# EAGLE board slave_board (EAGLE 9.2.2)
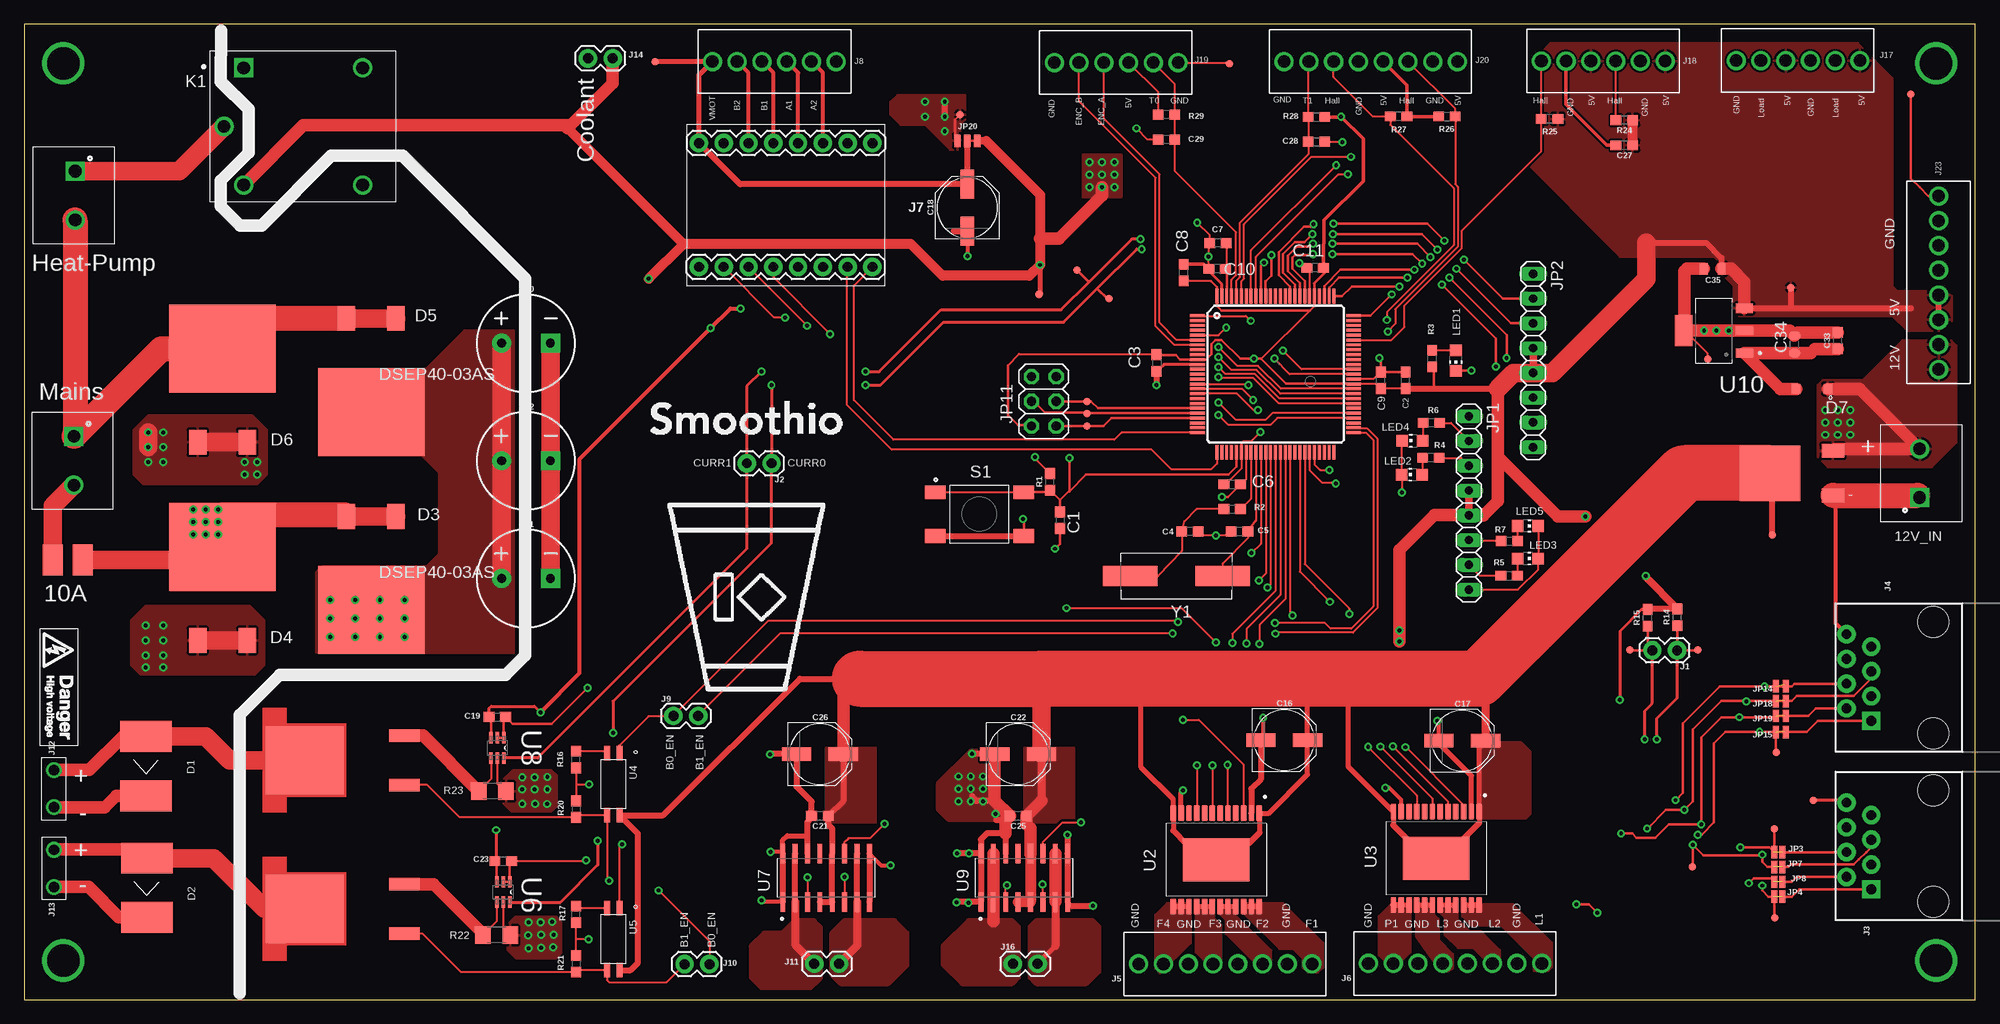
[diagram p6: board, top side]
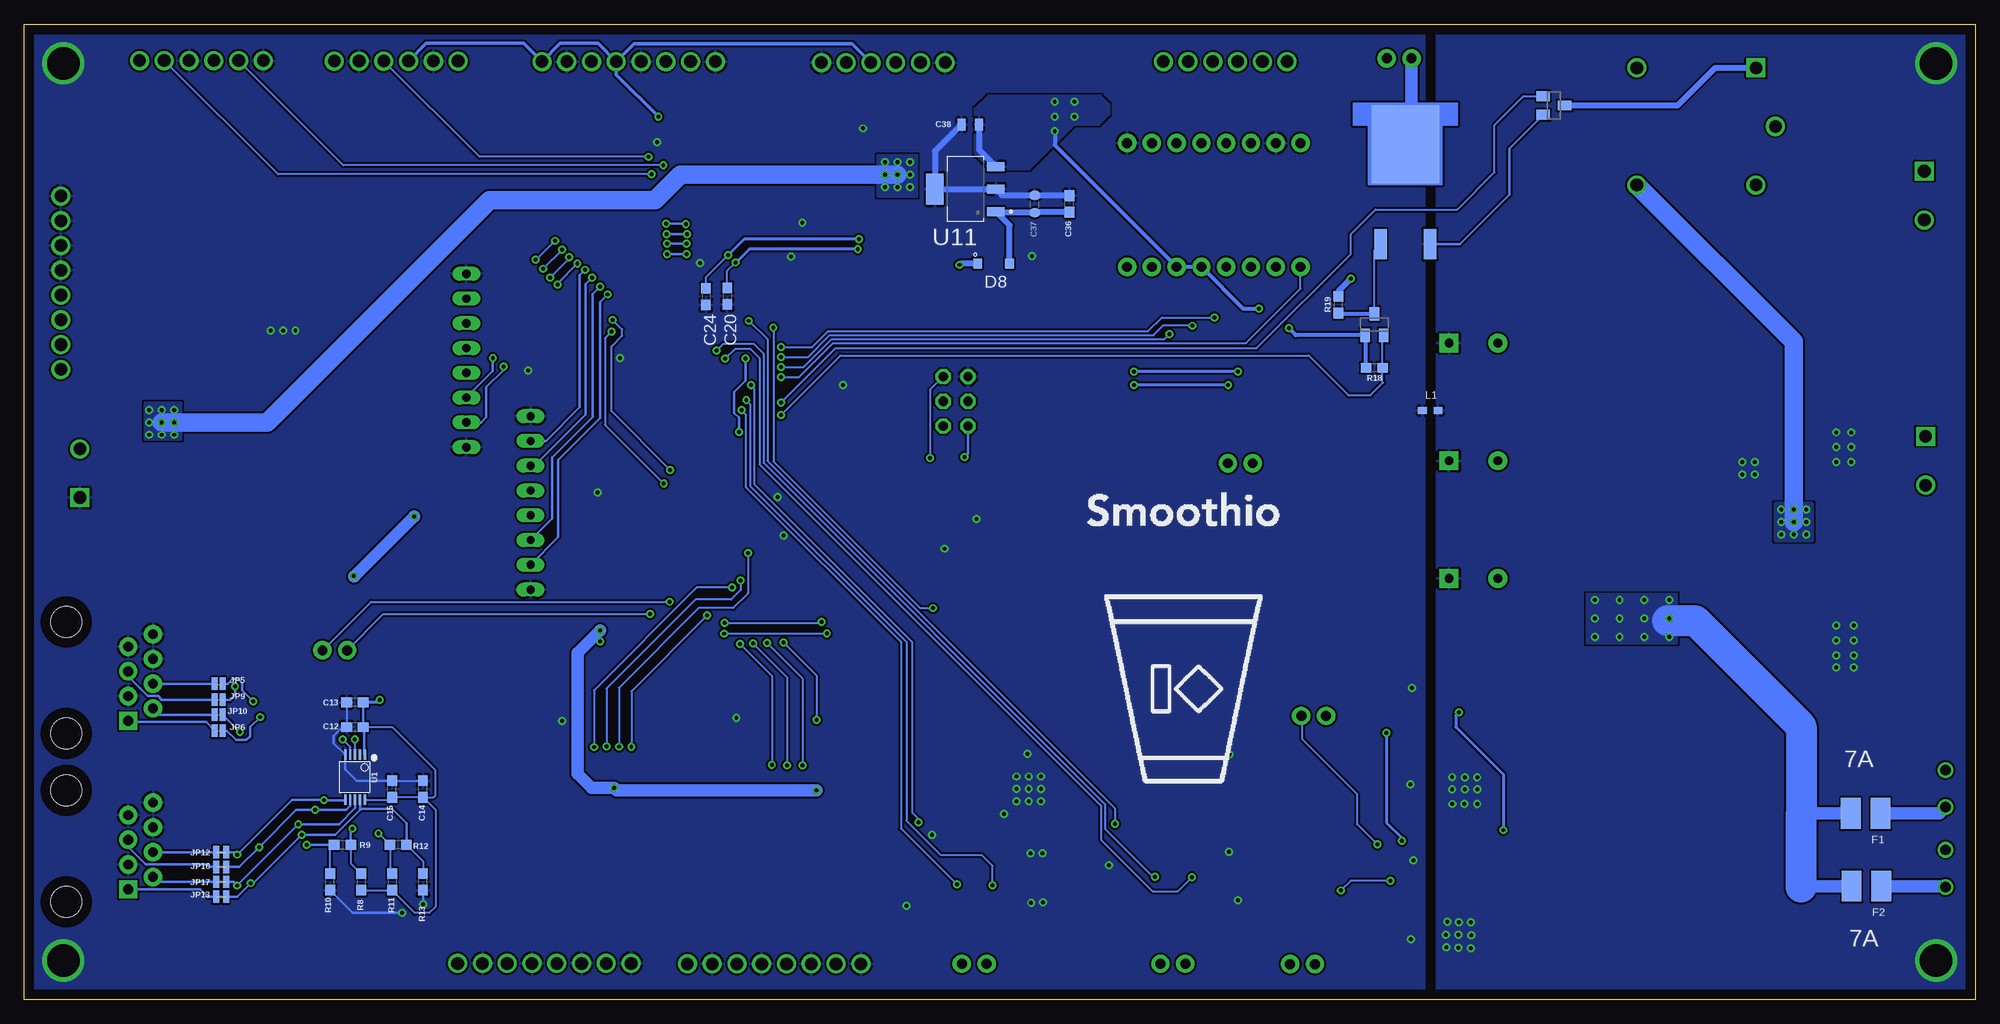
[diagram p7: board, bottom side, seen from below]

Size 200 x 100 mm. Coordinates in mm from the lower left corner, seen from the top.
Outline: 0,0 200,0 200,100 0,100 0,0
Copper layers (1*16): Top 0.07mm / dielectric 1.5mm / Bottom 0.07mm
Design rules "default *": minimum track width 6mil, minimum drill 0.35mm, track to track 8mil, track to pad 8mil, pad to pad 8mil, via to via 8mil, smd to smd 6mil, copper to edge 40mil, drill to drill 6mil, minimum pad ring 10mil, minimum via ring 8mil, stop-mask expansion 4mil, vias tented up to drill 0mil, thermal gap 10mil
Net classes: 0 default: width 0.203 mm, drill 0.406 mm, clearance 0.203 mm; 1 power: width 0.508 mm, drill 0.406 mm, clearance 0.254 mm; 2 gnd: width 0.203 mm, drill 0.406 mm, clearance 0.203 mm; 3 mains: width 1.905 mm, drill 0.406 mm, clearance 2.286 mm; 4 HVDC: width 1.27 mm, drill 0.406 mm, clearance 2.032 mm

## Footprints (pad centres in the part's own frame; a part is rotated, then mirrored left to right if it is on the bottom)
C0603 = smd 1.1 x 1: 1 -0.85,0; 2 0.85,0
0603 = smd 1.1 x 1: 1 -0.85,0; 2 0.85,0
PANASONIC_D = smd 3 x 1.4: + 2.4,0; - -2.4,0
UCS2E470MHD1TO = drill 0.9 pad 1.93: + -2.5,0 | drill 0.9 pad 1.93 square: - 2.5,0
C0603-ROUND = smd 0.898 x 1.1: 1 -0.889,0; 2 0.889,0
0805 = smd 0.8 x 1.2: 1 -0.9,0; 2 0.9,0
SK520TR = smd 3.175 x 5.283: 1 -3.175,0; 2 2.896,0
DSEP40-03AS = smd 1.778 x 2.54: 1 -2.54,0; 3 2.54,0 | smd 10.922 x 9.017: 4 0,9.588
MBR0530 = smd 0.899 x 1.021: 1 -1.778,0; 2 1.491,0
SSQ7 = smd 2.032 x 3.175: 1 1.524,0; 2 -1.524,0
SSQ10 = smd 2.032 x 3.175: 1 1.524,0; 2 -1.524,0
TQFP100 = smd 1.5 x 0.3: 1 -8,6; 2 -8,5.5; 3 -8,5; 4 -8,4.5; 5 -8,4; 6 -8,3.5; 7 -8,3; 8 -8,2.5; 9 -8,2; 10 -8,1.5; 11 -8,1; 12 -8,0.5; 13 -8,0; 14 -8,-0.5; 15 -8,-1; 16 -8,-1.5; 17 -8,-2; 18 -8,-2.5; 19 -8,-3; 20 -8,-3.5; 21 -8,-4; 22 -8,-4.5; 23 -8,-5; 24 -8,-5.5; 25 -8,-6; 51 8,-6; 52 8,-5.5; 53 8,-5; 54 8,-4.5; 55 8,-4; 56 8,-3.5; 57 8,-3; 58 8,-2.5; 59 8,-2; 60 8,-1.5; 61 8,-1; 62 8,-0.5; 63 8,0; 64 8,0.5; 65 8,1; 66 8,1.5; 67 8,2; 68 8,2.5; 69 8,3; 70 8,3.5; 71 8,4; 72 8,4.5; 73 8,5; 74 8,5.5; 75 8,6 | smd 0.3 x 1.5: 26 -6,-8; 27 -5.5,-8; 28 -5,-8; 29 -4.5,-8; 30 -4,-8; 31 -3.5,-8; 32 -3,-8; 33 -2.5,-8; 34 -2,-8; 35 -1.5,-8; 36 -1,-8; 37 -0.5,-8; 38 0,-8; 39 0.5,-8; 40 1,-8; 41 1.5,-8; 42 2,-8; 43 2.5,-8; 44 3,-8; 45 3.5,-8; 46 4,-8; 47 4.5,-8; 48 5,-8; 49 5.5,-8; 50 6,-8; 76 6,8; 77 5.5,8; 78 5,8; 79 4.5,8; 80 4,8; 81 3.5,8; 82 3,8; 83 2.5,8; 84 2,8; 85 1.5,8; 86 1,8; 87 0.5,8; 88 0,8; 89 -0.5,8; 90 -1,8; 91 -1.5,8; 92 -2,8; 93 -2.5,8; 94 -3,8; 95 -3.5,8; 96 -4,8; 97 -4.5,8; 98 -5,8; 99 -5.5,8; 100 -6,8
1X02 = drill 1.016 pad 1.88: 1 0,0; 2 2.54,0
RJ45-8 = drill 1 pad 1.88 square: 1 -4.445,6.35 | drill 1 pad 1.88: 2 -3.175,8.89; 3 -1.905,6.35; 4 -0.635,8.89; 5 0.635,6.35; 6 1.905,8.89; 7 3.175,6.35; 8 4.445,8.89 | hole 3.2: -5.715,0; 5.715,0
8PIN_SCREW_TERMINAL = drill 1.3: 1 1.5,3.25; 2 4.04,3.25; 3 6.58,3.25; 4 9.12,3.25; 5 11.66,3.25; 6 14.2,3.25; 7 16.74,3.25; 8 19.28,3.25
DRV8825CARRIER = drill 1.016 pad 1.88: /EN 0,0; /FLT 15.24,12.7; /RESET 10.16,0; /SLEEP 12.7,0; A1 10.16,12.7; A2 12.7,12.7; B1 7.62,12.7; B2 5.08,12.7; DIR 17.78,0; GND 2.54,12.7; GND1 17.78,12.7; M0 2.54,0; M1 5.08,0; M2 7.62,0; STEP 15.24,0; V-STEPPER 0,12.7
6PIN_SCREW_TERMINAL = drill 1.3: 1 1.5,3.25; 2 4.04,3.25; 3 6.58,3.25; 4 9.12,3.25; 5 11.66,3.25; 6 14.2,3.25
1X02_BIG = drill 1.067: P$1 0,0; P$2 3.81,0
PHOENIX_1935161 = drill 1.3 square: 1 -2.5,0 | drill 1.3: 2 2.5,0
1X08 = drill 0.85 pad 1.422 long: 1 -8.89,0; 2 -6.35,0; 3 -3.81,0; 4 -1.27,0; 5 1.27,0; 6 3.81,0; 7 6.35,0; 8 8.89,0
SMT-JUMPER_2_NO_NO-SILK = smd 0.635 x 1.27: 1 -0.406,0; 2 0.406,0
2X03 = drill 0.95 pad 1.55 octagon: 1 -2.54,-1.27; 2 -2.54,1.27; 3 0,-1.27; 4 0,1.27; 5 2.54,-1.27; 6 2.54,1.27
SMT-JUMPER_2_NC_TRACE_NO-SILK = smd 0.635 x 1.27: 1 -0.508,0; 2 0.508,0
SMT-JUMPER_3_1-NC_TRACE_NO-SILK = smd 0.635 x 1.27: 1 -1.016,0; 2 0,0; 3 1.016,0
ORWH-SH-112D1F = drill 1.3 square: A1 -6.1,6 | drill 1.3: A2 -6.1,-6; COM -8.1,0; NC 6.1,6; NO 6.1,-6
742792651 = smd 0.9 x 0.7: P$1 0.8,0; P$2 -0.8,0
CHIP-LED0805 = smd 1.2 x 1.2: A 0,-1.05; C 0,1.05
BSS138L = smd 1 x 1.4: D 0,1.1; G -0.95,-1.1; S 0.95,-1.1
PHB45NQ15T = smd 1.295 x 3.099: 1 -2.54,0; 3 2.54,0 | smd 6.985 x 8.001: 2 0,10.249
IRFR9024TRPBF = smd 5.69 x 6.172: D 0,6.439 | smd 1.397 x 2.286: G -2.286,0; S 2.286,0
CSR1206FT50L0 = smd 1.6 x 1.8: 1 -1.4,0; 2 1.4,0
FSM2JSMA = smd 2.1 x 1.4: 1 -4.55,2.25; 2 4.55,2.25; 3 -4.55,-2.25; 4 4.55,-2.25
PAD.03X.03 = smd 0.762 x 0.762: P$1 0,0
SPARKFUN-IC-COMMS_TSSOP10 = smd 1.1 x 0.25: 1 -2.259,1.018; 2 -2.259,0.517; 3 -2.259,0.018; 4 -2.259,-0.482; 5 -2.259,-0.988; 6 2.366,-0.988; 7 2.366,-0.482; 8 2.366,0.018; 9 2.366,0.517; 10 2.366,1.018
SOP80P1030X245-25N = smd 1.66 x 0.6: 1 -4.78,4.4; 2 -4.78,3.6; 3 -4.78,2.8; 4 -4.78,2; 5 -4.78,1.2; 6 -4.78,0.4; 7 -4.78,-0.4; 8 -4.78,-1.2; 9 -4.78,-2; 10 -4.78,-2.8; 11 -4.78,-3.6; 12 -4.78,-4.4; 13 4.78,-4.4; 14 4.78,-3.6; 15 4.78,-2.8; 16 4.78,-2; 17 4.78,-1.2; 18 4.78,-0.4; 19 4.78,0.4; 20 4.78,1.2; 21 4.78,2; 22 4.78,2.8; 23 4.78,3.6; 24 4.78,4.4 | smd 4.4 x 6.8: 25 0,0
EL3H7 = smd 1.5 x 0.6: 1 -3.175,0.635; 2 -3.175,-0.635; 3 3.175,-0.635; 4 3.175,0.635
SOT65P210X110-6N = smd 1.168 x 0.356: 1 -1.041,0.66; 2 -1.041,0; 3 -1.041,-0.66; 4 1.041,-0.66; 5 1.041,0; 6 1.041,0.66
VNH7070ASTR = smd 1.97 x 0.57: 1 -2.475,4.445; 2 -2.475,3.175; 3 -2.475,1.905; 4 -2.475,0.635; 5 -2.475,-0.635; 6 -2.475,-1.905; 7 -2.475,-3.175; 8 -2.475,-4.445; 9 2.475,-4.445; 10 2.475,-3.175; 11 2.475,-1.905; 12 2.475,-0.635; 13 2.475,0.635; 14 2.475,1.905; 15 2.475,3.175; 16 2.475,4.445
SOT230P700X180-4N = smd 1.76 x 0.93: 1 -3.125,2.3; 2 -3.125,0; 3 -3.125,-2.3 | smd 1.76 x 3.19: 4 3.125,0
ABLS-16.000MHZ-B4-T = smd 5.6 x 2.1: 1 -4.75,0; 2 4.75,0

## Placement (x,y rotation side)
C1  100n  [C0603]  106.17,49.15 270 top
C2  4.7uF  [C0603]  141.6,63.5 90 top
C3  100n  [C0603]  116.08,65.28 270 top
C4  15pF  [C0603]  119.51,48.01 180 top
C5  15pF  [C0603]  124.59,48.01 0 top
C6  100n  [C0603]  123.83,52.83 0 top
C7  1.0uF  [0603]  122.38,77.57 180 top
C8  100n  [C0603]  118.87,74.55 90 top
C9  100nF  [C0603]  139.06,63.5 90 top
C10  100n  [C0603]  122.3,74.93 180 top
C11  100n  [C0603]  132.33,75.03 180 top
C12  0.1uF  [C0603]  166.12,27.94 180 bottom
C13  1.0uF  [C0603]  166.12,30.48 180 bottom
C14  0.1uF  [C0603]  159.13,21.59 90 bottom
C15  1.0uF  [C0603]  162.31,21.59 90 bottom
C16  47uF  [PANASONIC_D]  129.17,26.6 0 top
C17  47uF  [PANASONIC_D]  147.42,26.54 0 top
C18  47uF  [PANASONIC_D]  96.67,81.2 90 top
C19  0.1uF  [C0603]  48.49,28.98 0 top
C20  0.1uF  [C0603]  127.94,72.14 270 bottom
C21  0.1uF  [C0603]  81.56,18.82 180 top
C22  47uF  [PANASONIC_D]  101.88,25.17 0 top
C23  0.1uF  [C0603]  49.1,14.2 0 top
C24  0.1uF  [C0603]  130.12,72.09 270 bottom
C25  0.1uF  [C0603]  101.88,18.82 180 top
C26  47uF  [PANASONIC_D]  81.56,25.17 0 top
C27  0.1uF  [0603]  164.02,87.6 180 top
C28  0.1uF  [0603]  132.48,87.97 0 top
C29  0.1uF  [0603]  117.1,88.18 180 top
C30  UCS2E470MHD1TO  [UCS2E470MHD1TO]  51.44,67.31 0 top
C31  UCS2E470MHD1TO  [UCS2E470MHD1TO]  51.44,43.18 0 top
C32  UCS2E470MHD1TO  [UCS2E470MHD1TO]  51.44,55.24 0 top
C33  1.0uF  [0603]  185.93,67.56 90 top
C34  100n  [C0603-ROUND]  181.48,67.18 90 top
C35  10uF  [0805]  173.1,74.93 180 top
C36  1.0uF  [0603]  92.86,81.58 90 bottom
C37  100n  [C0603-ROUND]  96.42,81.58 90 bottom
C38  10uF  [0805]  103.02,89.71 180 bottom
D1  SK520TR  [SK520TR]  12.47,23.8 270 top
D2  SK520TR  [SK520TR]  12.55,11.33 270 top
D3  DSEP40-03AS  [DSEP40-03AS]  35.56,49.53 180 top
D4  DSEP40-03AS  [DSEP40-03AS]  20.32,36.83 0 top
D5  DSEP40-03AS  [DSEP40-03AS]  35.56,69.85 180 top
D6  DSEP40-03AS  [DSEP40-03AS]  20.32,57.15 0 top
D7  MBR0530  [MBR0530]  183.13,62.61 180 top
D8  MBR0530  [MBR0530]  100.48,75.49 0 bottom
F1  SSQ7  [SSQ7]  11.23,19.08 180 bottom
F2  SSQ7  [SSQ7]  11.15,11.63 180 bottom
F3  SSQ10  [SSQ10]  4.45,45.09 180 top
IC1  ATMEGA2560-16AU  [TQFP100]  128.27,64.14 0 top
J1  [1X02]  169.44,35.81 180 top
J2  [1X02]  76.61,54.99 180 top
J3  RJ45  [RJ45-8]  195.71,15.75 90 top
J4  RJ45  [RJ45-8]  195.71,33.02 90 top
J5  OSTVN08A150  [8PIN_SCREW_TERMINAL]  112.74,0.4 0 top
J6  OSTVN08A150  [8PIN_SCREW_TERMINAL]  136.3,0.45 0 top
J7  DRV8825CARRIER  [DRV8825CARRIER]  69.16,75.13 0 top
J8  OSTVN06A150  [6PIN_SCREW_TERMINAL]  84.73,99.44 180 top
J9  [1X02]  66.55,29.08 0 top
J10  [1X02]  70.23,3.63 180 top
J11  [1X02]  80.98,3.66 0 top
J12  [1X02_BIG]  3.02,19.72 90 top
J13  [1X02_BIG]  3.03,11.54 90 top
J14  [1X02]  60.33,96.52 180 top
J15  1935161  [PHOENIX_1935161]  5.21,82.45 270 top
J16  [1X02]  101.35,3.66 0 top
J17  OSTVN06A150  [6PIN_SCREW_TERMINAL]  174,93.04 0 top
J18  OSTVN06A150  [6PIN_SCREW_TERMINAL]  154.03,92.99 0 top
J19  OSTVN06A150  [6PIN_SCREW_TERMINAL]  104.09,92.84 0 top
J20  OSTVN08A150  [8PIN_SCREW_TERMINAL]  127.66,92.93 0 top
J21  1935161  [PHOENIX_1935161]  5.08,55.24 270 top
J22  1935161  [PHOENIX_1935161]  194.31,53.98 90 top
J23  OSTVN08A150  [8PIN_SCREW_TERMINAL]  193,83.9 270 top
JP1  8x1F-H8.5  [1X08]  148.11,50.93 270 top
JP2  8x1F-H8.5  [1X08]  154.69,65.53 270 top
JP3  JUMPER-SMT_2_NO_NO-SILK  [SMT-JUMPER_2_NO_NO-SILK]  179.83,15.11 0 top
JP4  JUMPER-SMT_2_NO_NO-SILK  [SMT-JUMPER_2_NO_NO-SILK]  179.83,10.54 0 top
JP5  JUMPER-SMT_2_NO_NO-SILK  [SMT-JUMPER_2_NO_NO-SILK]  180.09,32.38 180 bottom
JP6  JUMPER-SMT_2_NO_NO-SILK  [SMT-JUMPER_2_NO_NO-SILK]  180.09,27.56 180 bottom
JP7  JUMPER-SMT_2_NO_NO-SILK  [SMT-JUMPER_2_NO_NO-SILK]  179.83,13.59 0 top
JP8  JUMPER-SMT_2_NO_NO-SILK  [SMT-JUMPER_2_NO_NO-SILK]  179.83,12.06 0 top
JP9  JUMPER-SMT_2_NO_NO-SILK  [SMT-JUMPER_2_NO_NO-SILK]  180.09,30.73 180 bottom
JP10  JUMPER-SMT_2_NO_NO-SILK  [SMT-JUMPER_2_NO_NO-SILK]  180.09,29.21 180 bottom
JP11  3x2M  [2X03]  104.52,61.34 90 top
JP12  JUMPER-SMT_2_NC_TRACE_NO-SILK  [SMT-JUMPER_2_NC_TRACE_NO-SILK]  179.83,15.11 0 bottom
JP13  JUMPER-SMT_2_NC_TRACE_NO-SILK  [SMT-JUMPER_2_NC_TRACE_NO-SILK]  179.83,10.54 0 bottom
JP14  JUMPER-SMT_2_NC_TRACE_NO-SILK  [SMT-JUMPER_2_NC_TRACE_NO-SILK]  180.09,32.13 180 top
JP15  JUMPER-SMT_2_NC_TRACE_NO-SILK  [SMT-JUMPER_2_NC_TRACE_NO-SILK]  180.09,27.43 180 top
JP16  JUMPER-SMT_2_NC_TRACE_NO-SILK  [SMT-JUMPER_2_NC_TRACE_NO-SILK]  179.83,13.59 0 bottom
JP17  JUMPER-SMT_2_NC_TRACE_NO-SILK  [SMT-JUMPER_2_NC_TRACE_NO-SILK]  179.83,12.06 0 bottom
JP18  JUMPER-SMT_2_NC_TRACE_NO-SILK  [SMT-JUMPER_2_NC_TRACE_NO-SILK]  180.09,30.61 180 top
JP19  JUMPER-SMT_2_NC_TRACE_NO-SILK  [SMT-JUMPER_2_NC_TRACE_NO-SILK]  180.09,29.08 180 top
JP20  JUMPER-SMT_3_1-NC_TRACE_NO-SILK  [SMT-JUMPER_3_1-NC_TRACE_NO-SILK]  96.67,88.06 0 top
K1  ORWH-SH-112D1F  [ORWH-SH-112D1F]  28.57,89.53 0 top
L1  742792651  [742792651]  55.85,60.4 0 bottom
LED1  GREEN  [CHIP-LED0805]  146.76,65.53 180 top
LED2  GREEN  [CHIP-LED0805]  142.27,53.82 90 top
LED3  GREEN  [CHIP-LED0805]  154.15,45.21 270 top
LED4  GREEN  [CHIP-LED0805]  142.32,57.3 90 top
LED5  GREEN  [CHIP-LED0805]  154.15,48.56 270 top
Q1  BSS138L  [BSS138L]  43.18,91.69 270 bottom
Q2  BSS138L  [BSS138L]  61.59,69.22 0 bottom
Q3  PHB45NQ15T  [PHB45NQ15T]  58.42,77.47 0 bottom
Q4  PHB45NQ15T  [PHB45NQ15T]  38.96,24.54 90 top
Q5  PHB45NQ15T  [PHB45NQ15T]  38.96,9.3 90 top
Q6  IRFR9024TRPBF  [IRFR9024TRPBF]  185.42,53.98 90 top
R1  10k  [0603]  105.16,53.09 90 top
R2  0  [0603]  123.83,50.29 0 top
R3  1k  [0603]  144.32,65.74 90 top
R4  1k  [0603]  144.2,55.55 180 top
R5  1k  [0603]  152.22,43.46 0 top
R6  1k  [0603]  144.25,59.13 180 top
R7  1k  [0603]  152.25,47.02 0 top
R8  390  [0603]  165.48,12.06 270 bottom
R9  100  [0603]  167.39,15.88 0 bottom
R10  390  [0603]  168.66,12.06 90 bottom
R11  390  [0603]  162.31,12.06 270 bottom
R12  100  [0603]  161.67,15.88 180 bottom
R13  390  [0603]  159.13,12.06 90 bottom
R14  4.7k  [0603]  169.47,39.19 90 top
R15  4.7k  [0603]  166.42,39.14 90 top
R16  220  [0603]  56.57,24.61 90 top
R17  220  [0603]  56.57,8.74 90 top
R18  10k  [0603]  61.59,64.77 180 bottom
R19  10k  [0603]  65.28,71.25 90 bottom
R20  1M  [0603]  56.57,19.53 270 top
R21  1M  [0603]  56.57,3.66 270 top
R22  CSR1206FT50L0  [CSR1206FT50L0]  48.41,6.6 180 top
R23  CSR1206FT50L0  [CSR1206FT50L0]  47.98,21.36 180 top
R24  10k  [0603]  164.02,90.17 180 top
R25  10k  [0603]  156.36,90.3 180 top
R26  10k  [0603]  145.85,90.55 0 top
R27  10k  [0603]  140.89,90.55 180 top
R28  51K  [0603]  132.48,90.51 0 top
R29  51K  [0603]  117.1,90.74 180 top
S1  FSM2JSMA  [FSM2JSMA]  97.92,49.78 0 top
TP1  TEST-POINT3  [PAD.03X.03]  111.2,71.86 0 top
TP2  TEST-POINT3  [PAD.03X.03]  104.04,72.31 90 top
TP3  TEST-POINT3  [PAD.03X.03]  172.59,65.66 90 top
TP4  TEST-POINT3  [PAD.03X.03]  183.39,20.45 90 top
TP5  TEST-POINT3  [PAD.03X.03]  193.42,92.84 90 top
TP6  TEST-POINT3  [PAD.03X.03]  123.57,95.99 90 top
TP7  TEST-POINT3  [PAD.03X.03]  108.97,60.07 90 top
TP8  TEST-POINT3  [PAD.03X.03]  108.97,58.8 90 top
TP9  TEST-POINT3  [PAD.03X.03]  108.97,61.34 90 top
TP10  TEST-POINT3  [PAD.03X.03]  179.43,17.53 90 top
TP11  TEST-POINT3  [PAD.03X.03]  170.99,13.61 90 top
TP12  TEST-POINT3  [PAD.03X.03]  179.48,8.38 90 top
TP13  TEST-POINT3  [PAD.03X.03]  179.6,25.32 90 top
TP14  TEST-POINT3  [PAD.03X.03]  171.55,35.84 90 top
TP15  TEST-POINT3  [PAD.03X.03]  164.59,35.84 90 top
TP16  TEST-POINT3  [PAD.03X.03]  64.67,96.16 90 top
TP17  TEST-POINT3  [PAD.03X.03]  179.2,47.62 90 top
TP18  TEST-POINT3  [PAD.03X.03]  181.1,73.03 90 top
TP19  TEST-POINT3  [PAD.03X.03]  95.91,90.73 0 top
TP20  TEST-POINT3  [PAD.03X.03]  107.92,74.8 0 top
U1  PCA9615  [SPARKFUN-IC-COMMS_TSSOP10]  166.12,22.86 270 bottom
U2  VNQ5E160KTR-E  [SOP80P1030X245-25N]  122.2,14.33 270 top
U3  VNQ5E160KTR-E  [SOP80P1030X245-25N]  144.75,14.48 270 top
U4  EL3H7  [EL3H7]  60.38,22.07 270 top
U5  EL3H7  [EL3H7]  60.38,6.2 270 top
U6  INA213AIDCKT  [SOT65P210X110-6N]  49.1,11.02 270 top
U7  VNH7070ASTR  [VNH7070ASTR]  82.19,12.47 90 top
U8  INA213AIDCKT  [SOT65P210X110-6N]  48.49,25.81 270 top
U9  VNH7070ASTR  [VNH7070ASTR]  102.51,12.47 90 top
U10  LM340MP-5.0/NOPB  [SOT230P700X180-4N]  173.23,68.58 180 top
U11  LM340MP-5.0/NOPB  [SOT230P700X180-4N]  103.53,83.11 180 bottom
Y1  ABLS-16.000MHZ-B4-T  [ABLS-16.000MHZ-B4-T]  118.11,43.43 0 top

## Tracks (layer width: path | path; a pad name or v marks a point on that pad's centre or on a via)
+5V  (via drill 0.41)
  Top 0.203: IC1.80 132.26,72.15 | IC1.61 138.54,63.13 C9.1 C2.1 | IC1.31 124.77,54.44 123.17,52.83 C6.1 | 126.85,65.67 126.85,65.71 | R29.2 116.25,93.05 J19.4 | 134.96,90.57 v135,90.53
  Top 0.254: 132.26,73.46 132.26,72.15 | C8.1 121.67,73.66 122.27,73.06 IC1.100 122.27,71.1 122.73,70.64 131.78,70.64 | R1.2 103.63,55.46 v103.63,55.63 | JP11.2 103.12,58.93 101.85,58.93 100.84,59.94 100.84,65.02 101.98,66.17 C3.1 116.14,66.06 118.06,66.06 118.49,65.64 IC1.10 121.14,65.64 121.69,66.19 121.69,67.2 122.12,67.63 122.73,67.63 124.65,65.71 v126.06,65.71 126.85,65.71 131.78,70.64 | R3.1 144.53,64.68 144.53,62.65 | IC1.80 132.27,71.13 131.78,70.64 | IC1.61 136.25,63.16 129.36,63.16 126.85,65.67 | v126.75,58.19 125.77,57.22 124.98,57.22 124.77,57 IC1.31
  Top 0.305: C11.1 133.22,74.42 132.26,73.46 | R15.2 165.8,39.99 163.58,37.77 v163.58,30.73
  Top 0.356: C11.1 133.22,79.91 137.26,83.95 137.26,88.27 v135,90.53 | R28.2 134.9,90.51 134.96,90.57 | R26.1 R27.1 141.74,93.75 J20.5
  Top 0.406: U3.11 141.16,20.49 139.93,21.72 v139.55,21.72
  Top 0.508: U2.11 118.6,21.27 v118.77,21.44
  Top 0.635: R14.2 166.47,40.04 R15.2 | C2.1 144.53,62.65 151.07,62.65 | 166.27,77.6 172.44,77.6 174,76.04 C35.1 | U10.3 181.18,70.88 | 181.18,70.88 193.44,70.88 | TP18.P$1 181.1,70.96 181.18,70.88 | J23.6 J23.5
  Top 0.762: v166.24,43.43 166.24,43.31 169.49,40.06 R14.2 | JP1.5 JP1.4 | JP2.4 JP2.5
  Top 1.016: R24.1 C27.1
  Top 1.27: C35.1 175.01,74.93 176.35,73.58 U10.3 | 151.07,62.65 151.07,55.67 | v160.02,49.53 157.21,49.53 151.07,55.67 | 151.07,55.67 151.07,51.12 149.61,49.66 JP1.5 148.08,49.68 144.55,49.68 140.97,46.1 v140.97,37.85 v140.97,36.7
  Top 1.905: 151.07,62.65 152.68,64.26 JP2.5 156.67,64.26 166.27,73.86 166.27,77.6
  Bottom 0.203: 165.18,27.86 C12.1 162.31,27.94 157.86,23.5 157.86,20.95 158.08,20.74 C14.1 | C14.1 C15.1 162.55,20.49 U1.10 | C14.1 157.86,19.47 157.86,9.53 158.5,8.89 159.98,8.89 R11.2 R8.2
  Bottom 0.254: JP11.2 103.25,56.01 v103.63,55.63 | U1.1 165.14,25.16 165.14,25.81 165.18,25.84 165.18,27.86 | C12.1 C13.1 | v126.06,65.71 126.06,63.45 127.23,62.28 127.23,60.15 126.75,59.66 v126.75,58.19
  Bottom 0.305: v163.58,30.73 163.83,30.48 C13.1
  Bottom 0.356: J20.5 141.18,98.04 145.07,98.04 J20.8 148.8,98.04 158.8,98.04 J18.3 | J20.5 137.48,98.02 115.14,98.02 J19.4 | v135,90.53 139.31,94.84 J20.5
  Bottom 0.635: 166.18,43.37 v166.24,43.43
  Bottom 1.27: v160.02,49.53 166.18,43.37 | v140.97,37.85 143.26,35.56 143.26,23.14 141.83,21.72 v139.55,21.72 139.27,21.44 v118.77,21.44
  pour Top: 175.77,70.1 191.52,70.1 193.04,68.58 196.58,68.58 197.6,69.6 197.6,72.14 197.09,72.64 192.02,72.64 191.52,73.15 191.52,94.49 187.96,98.04 156.46,98.04 153.42,95 153.42,86.36 163.58,76.2 173.23,76.2 173.74,75.69 173.74,74.68 175.26,73.15 175.26,70.61
+12V  (via drill 0.41)
  Top 0.508: v104.14,75.34 104.14,72.42
  Top 0.635: 104.14,72.42 TP2.P$1
  Top 0.762: JP20.3 98.6,88.06
  Top 1.016: 98.6,88.06 104.14,82.53 104.14,78.03 v104.14,75.34 103.02,74.22 94.13,74.22 90.88,77.47 67.56,77.47 | 67.56,77.47 v64.01,73.91 | 67.56,77.47 55.69,89.34
  Top 1.27: K1.A2 28.58,89.64 55.98,89.64 | 55.69,89.34 55.98,89.64 | 55.98,89.64 60.33,93.98 J14.1 | Q6.S 185.63,56.48 J22.2 188.17,62.61 D7.1 | 104.14,78.03 106.07,78.03 110.49,82.45 v110.49,83.31
  Bottom 0.635: D8.1 103.99,75.49 v104.14,75.34 | v64.01,73.91 65.28,72.64 R19.2
  Bottom 1.905: v185.93,59.18 175.08,59.18 152.29,81.98 135.34,81.98 132.74,84.58 v110.49,84.58
  other vias: 110.49,85.85 109.22,85.85 109.22,84.58 109.22,83.31 111.76,83.31 111.76,85.85 111.76,84.58 184.66,60.45 185.93,60.45 187.2,60.45 187.2,59.18 184.66,59.18 184.66,57.91 185.93,57.91 187.2,57.91
  pour Top: 198.07,67.06 198.07,57.1 195.58,54.61 184.91,54.61 183.9,55.63 183.9,62.99 184.4,63.5 188.47,63.5 192.53,67.56 197.56,67.56
  pour Top: 108.46,86.61 108.46,82.3 112.52,82.3 112.52,86.61
  pour Bottom: 108.46,86.61 108.46,82.3 112.52,82.3 112.52,86.61
  pour Bottom: 183.9,61.21 187.71,61.21 187.71,57.4 183.9,57.4 183.9,60.96
/EN  (via drill 0.41)
  Top 0.203: IC1.57 128.6,61.13 125.98,63.75 122.52,63.75 v122.43,63.85
  Bottom 0.203: v122.43,63.85 120.56,63.85 117.09,67.31 74.75,67.31 69.16,72.9 J7./EN
A1
  Top 0.406: J7.A1 79.32,95.02 J8.3
A2
  Top 0.406: J7.A2 81.86,95.02 J8.2
ADD_A12  (via drill 0.41)
  Top 0.254: JP2.2 151.56,71.88 v147.57,75.87 | v145.59,77.8 143.84,79.55 v134.19,79.55 | v132.18,79.53 131.9,79.25 131.21,79.25 128.6,76.64 128.6,74.28 129.77,73.12 IC1.85
  Bottom 0.254: v145.59,77.8 147.52,75.87 v147.57,75.87 | v134.19,79.55 132.21,79.55 v132.18,79.53
ADD_A13  (via drill 0.41)
  Top 0.254: JP2.3 152.4,69.34 v146.81,74.93 | v144.88,76.89 143.26,78.51 v134.16,78.51 | v132.06,78.51 131.22,77.67 130.28,77.67 129.06,76.45 129.06,74.53 130.27,73.31 IC1.84
  Bottom 0.254: v146.81,74.93 144.88,76.86 v144.88,76.89 | v134.16,78.51 v132.06,78.51
ADD_A14  (via drill 0.41)
  Top 0.254: v151.97,65.79 151.97,68.15 v146.1,74.02 | v144.15,76.15 142.8,77.5 v134.11,77.5 | v132.1,77.5 131.83,77.22 130.47,77.22 129.54,76.29 129.54,74.72 130.77,73.48 IC1.83
  Bottom 0.254: JP2.6 151.97,64.44 v151.97,65.79 | v146.1,74.02 144.15,75.97 v144.15,76.15 | v134.11,77.5 v132.1,77.5
ADD_A15  (via drill 0.41)
  Top 0.254: v150.88,64.9 150.88,67.79 v145.34,73.33 | v143.31,75.46 142.32,76.45 v134.09,76.45 | v132.1,76.45 132,76.35 130.25,76.35 130,76.1 130,74.95 131.27,73.68 IC1.82
  Bottom 0.254: JP2.7 153.19,59.18 152.65,59.72 152.65,62.79 150.88,64.57 v150.88,64.9 | v145.34,73.33 145.34,73.43 v143.31,75.46 | v134.09,76.45 v132.1,76.45
ADD_D22  (via drill 0.41)
  Top 0.203: R6.1 146.25,59.13 JP1.2
  Top 0.254: IC1.78 133.29,72.16 133.29,73.17 134.95,74.83 v142.49,74.83
  Bottom 0.254: JP1.2 146.51,57.28 143.05,60.73 143.05,74.27 v142.49,74.83
ADD_D23  (via drill 0.41)
  Top 0.203: R4.1 147.29,55.55 JP1.3
  Top 0.254: IC1.77 133.79,72.16 133.79,73.02 134.78,74.02 v141.81,74.02
  Bottom 0.254: JP1.3 147.68,54.74 142.44,59.97 142.44,73.38 v141.81,74.02
ADD_D24  (via drill 0.41)
  Top 0.203: R7.1 148.21,47.02 JP1.6
  Top 0.254: v140.97,73.13 136.09,73.13 135.08,72.11 134.29,72.11 IC1.76
  Bottom 0.254: JP1.6 145.9,49.33 145.9,55.58 141.73,59.74 141.73,72.36 v140.97,73.13
ADD_D25  (via drill 0.41)
  Top 0.203: R5.1 149.22,43.46 JP1.7
  Top 0.254: v140.18,72.31 138,70.14 IC1.75
  Bottom 0.254: JP1.7 145.26,47.42 145.26,55.32 140.97,59.61 140.97,71.53 v140.18,72.31
AREF
  Top 0.203: C7.1 123.23,75.01 C10.1
  Top 0.254: IC1.98 123.27,74.85
  Top 0.305: 123.27,74.85 C10.1
B1
  Top 0.406: J7.B1 76.78,95.02 J8.4
B2
  Top 0.406: J7.B2 74.24,95.02 J8.5
BLENDER0-
  Top 1.27: D1.1 10.11,26.98 6.66,23.53 J12.P$2
  Top 1.905: Q4.2 21.03,24.54 18.59,26.98 D1.1
BLENDER0_EN  (via drill 0.41)
  Top 0.203: IC1.51 137.52,58.13 138.3,57.35 138.3,40.31 136.04,38.05 133.91,38.05 133.32,38.63 v128.19,38.63 | v118.26,38.73 118.19,38.81 76.22,38.81 66.55,29.13 J9.1 66.52,29.06 63.98,29.06 61.01,26.09 U4.1
  Bottom 0.203: v128.19,38.63 118.36,38.63 v118.26,38.73
BLENDER0_GATE  (via drill 0.41)
  Top 0.203: Q4.1 41.3,22 44.61,18.68 R20.2 56.78,18.9 U4.3 59.74,12.39 v59.94,12.19 | v65.02,11.18 70.23,5.97 J10.1
  Bottom 0.203: v59.94,12.19 64.01,12.19 v65.02,11.18
BLENDER1-
  Top 1.27: J13.P$2 3.08,15.4 11.65,15.4 D2.1
  Top 1.905: D2.1 19.41,14.5 24.61,9.3 Q5.2
BLENDER1_EN  (via drill 0.41)
  Top 0.203: IC1.52 136.31,58.59 137.64,58.59 138.71,57.52 138.71,40.14 136.21,37.64 128.25,37.64 v128.25,37.52 | v61.29,15.9 60.98,15.6 60.98,9.4 U5.1 | v117.73,37.54 77.5,37.54 69.09,29.13 J9.2
  Bottom 0.203: v128.25,37.52 117.73,37.52 v117.73,37.54 | v61.29,15.9 63.4,18.01 63.4,21.11 69.01,26.72 69.01,29.01 J9.2
BLENDER1_GATE
  Top 0.203: Q5.1 40.82,6.76 44.77,2.81 R21.2 56.78,3.02 U5.3 59.74,1.98 59.94,1.78 65.84,1.78 J10.2
CAROUSEL_POS  (via drill 0.41)
  Top 0.203: R24.2 163.18,96.21 J18.4 | IC1.95 124.77,73.66 125.04,73.93 125.04,79.51 131.94,86.41 v136.02,86.41
  Bottom 0.203: v136.02,86.41 153.32,86.41 J18.4
COOLANT-
  Bottom 1.27: J14.2 57.78,88.35 Q3.2
COOLANT_EN  (via drill 0.41)
  Top 0.203: IC1.54 128.47,59.63 127.76,58.93 123.44,58.93 v122.43,59.94
  Bottom 0.203: Q2.S 60.74,68.02 R18.1 60.74,63.28 60.71,63.25 61.98,61.98 64.26,61.98 68.33,66.04 116.33,66.04 v122.43,59.94
COOLANT_GATE
  Bottom 0.203: Q2.D 61.59,76.83 Q3.1
  Bottom 0.406: Q2.D 65.2,70.31 R19.1
CUP_MASS0  (via drill 0.41)
  Top 0.203: IC1.93 125.77,76.82 v134.49,85.55
  Bottom 0.203: v134.49,85.55 167.29,85.55 J17.2
CUP_MASS1  (via drill 0.41)
  Top 0.203: v135.71,84.63 135.99,84.63 136.04,84.58 134.68,84.58 126.27,76.17 IC1.92
  Bottom 0.203: v135.71,84.63 174,84.63 J17.5
CURR_SENS0  (via drill 0.41)
  Top 0.254: IC1.91 126.77,75.28 v127.08,75.59
  Top 0.305: v86.23,62.99 87.76,62.99 94.23,69.47 106.55,69.47 109.98,72.9 | v114.55,76.96 114.05,76.96 109.98,72.9 | 109.98,72.9 111.02,71.86 TP1.P$1 | v58.78,16.26 58.78,13.79 54.97,9.98 U6.6 | v60.35,27.33 60.35,30.58 76.58,46.81 76.58,54.97 J2.1 76.58,55.02 v76.58,62.99
  Bottom 0.203: C20.1 127.94,74.73 v127.08,75.59
  Bottom 0.305: v76.58,62.99 v86.23,62.99 | v114.55,76.96 125.65,76.96 127.03,75.59 v127.08,75.59 | v60.35,27.33 60.35,18.14 58.78,16.56 v58.78,16.26
CURR_SENS1  (via drill 0.41)
  Top 0.254: v127.84,76.35 127.84,74.22 127.31,73.69 127.28,73.69 127.25,73.66 127.25,72.15 IC1.90
  Top 0.305: v75.56,64.39 74.07,62.89 J2.2 74.07,46.2 52.63,24.77 U8.6 | v86.23,64.39 87.63,64.39 93.98,70.74 106.3,70.74 109.18,73.62 | 109.18,73.62 113.54,77.98 v114.43,77.98 | TP20.P$1 109.11,73.62 109.18,73.62
  Bottom 0.203: C24.1 130.12,74.07 v127.84,76.35
  Bottom 0.305: v75.56,64.39 v86.23,64.39 | v114.43,77.98 126.21,77.98 v127.84,76.35
CURRSENS0-
  Top 0.203: U8.4 47.83,22.61 R23.2
  Top 1.27: Q4.3 40.87,27.08 R23.2
CURRSENS1-
  Top 0.203: U6.4 48.44,8.03 47.1,6.69
  Top 1.27: R22.2 47.1,6.69 41.96,11.84 Q5.3
DIR
  Top 0.203: IC1.25 112.49,58.13 111.76,57.4 89.1,57.4 85.04,61.47 85.04,73.23 J7.DIR
DSCL+  (via drill 0.41)  (2 unrouted)
  Top 0.254: v175.95,15.62 178.92,15.62 JP3.1 TP10.P$1 | v166.37,17.53 168.28,19.43 v170.18,19.43 171.07,20.32 171.07,27.69 173.99,30.61 176.56,30.61 | 176.56,30.61 v176.53,30.58 | JP18.2 176.56,30.61 | JP18.1 181.23,30.61 181.74,31.11 187.56,31.11 189.36,32.91 J4.5 | JP7.2 180.85,13.59 181.1,13.84 187.58,13.84 188.09,14.35 188.09,14.37 188.83,15.11 188.85,15.11 189.36,15.62 J3.5
  Bottom 0.203: R8.1 166.54,13.97 R9.2 166.6,15.94
  Bottom 0.254: JP16.2 177.98,13.59 v175.95,15.62 172.14,19.43 v170.18,19.43 167,19.43 166.6,19.84 U1.7 | R9.2 166.54,17.36 v166.37,17.53 | JP5.1 179.17,32.38 178.69,32.87 178.08,32.87 177.65,32.44 177.65,31.7 v176.53,30.58 | JP9.2 185.91,30.73 186.29,31.11 187.34,31.11 188.14,31.91 188.14,31.9 189.36,33.12 J4.5 | JP16.1 180.85,13.59 181.1,13.84 187.56,13.84 189.36,15.64 J3.5
DSCL-  (via drill 0.41)  (2 unrouted)
  Top 0.254: JP7.1 178.69,13.59 178.18,14.1 v178.18,14.86 178.13,14.81 172.14,14.81 v171.07,15.88 171.07,13.69 TP11.P$1 | JP14.2 179.55,32.11 v178.41,32.11 173.84,32.11 170.05,28.32 170.05,21.21 v169.29,20.45 | JP14.1 181.23,32.13 181.48,32.38 J4.4 | JP3.2 J3.4
  Bottom 0.203: R10.2 168.66,15.46 R9.1
  Bottom 0.254: R9.1 v171.07,15.88 | JP9.1 178.92,30.73 178.41,31.24 v178.41,32.11 | U1.6 167.15,20.45 v169.29,20.45 169.34,20.49 172.55,20.49 v178.18,14.86 178.44,15.11 JP12.2 | JP5.2 J4.4 | JP12.1 J3.4
DSDA+  (via drill 0.41)  (2 unrouted)
  Top 0.254: 178.18,11.81 v178.18,11.68 178.18,11.18 178.82,10.54 JP4.1 179.43,8.43 TP12.P$1 | JP19.2 179.45,28.96 v175.84,28.96 173.99,28.96 171.91,26.87 v171.91,17.98 168.6,17.98 167.21,16.59 165.28,16.59 164.85,17.02 v163.7,17.02 | JP19.1 182.88,29.08 183.64,29.84 J4.2 | J3.2 181.74,12.57 181.23,12.06 JP8.2
  Bottom 0.203: R11.1 162.52,13.13 R12.2 162.94,15.88
  Bottom 0.254: U1.8 166.1,19.64 167.75,17.98 v171.91,17.98 178.18,11.71 v178.18,11.68 178.56,12.06 JP17.2 | R12.2 163.66,17.02 v163.7,17.02 | v175.84,28.96 176.86,27.94 176.86,27 177.24,26.62 178.31,26.62 179.25,27.56 JP6.1 | JP10.2 186.18,29.21 J4.2 | JP17.1 186.31,12.06 J3.2
DSDA-  (via drill 0.41)  (2 unrouted)
  Top 0.254: JP8.1 179.04,12.45 177.29,12.45 v176.78,11.94 | v171.58,16.89 171.96,16.89 173.23,18.16 173.23,26.29 174.37,27.43 v177.9,27.43 JP15.2 179.58,25.35 TP13.P$1 | JP15.1 182.75,27.43 183.9,28.57 J4.1 | JP4.2 181.23,10.54 181.99,11.3 J3.1
  Bottom 0.203: R13.2 159.13,14.19 R12.1 160.82,16.3
  Bottom 0.254: 165.6,19.57 165.6,19.43 168.14,16.89 v171.58,16.89 176.53,11.94 v176.78,11.94 178.18,10.54 JP13.2 | 165.6,19.57 U1.9 | R12.1 160.82,18.07 162.31,19.57 165.6,19.57 | JP10.1 v177.9,27.43 | JP6.2 181.38,28.45 189.23,28.45 J4.1 | J3.1 181.99,11.3 181.23,10.54 JP13.1
ELEV_ENC_A  (via drill 0.41)
  Top 0.203: J20.6 146.7,91.34 R26.2 146.7,83.62 146.96,83.35 146.96,77.2 140.56,70.8 140.56,69.29 v139.78,68.5 | IC1.45 131.77,54.28 133.02,53.03 134.31,53.03 v134.44,52.91
  Bottom 0.203: v134.44,52.91 140.46,58.93 140.46,67.82 v139.78,68.5
ELEV_ENC_B  (via drill 0.41)
  Top 0.203: J20.3 134.21,96.16 134.21,94.59 138.25,90.55 R27.2 140.04,89.7 146.56,83.19 146.56,77.37 139.7,70.51 v139.7,69.7 | IC1.46 132.27,54.88 132.84,54.3 v133.78,54.3
  Bottom 0.203: v133.78,54.3 139.8,60.33 139.8,66.98 138.71,68.07 138.71,68.71 v139.7,69.7
ELEV_INA  (via drill 0.41)
  Top 0.203: U9.3 100.61,11.58 v100.74,11.71 | IC1.16 124.82,62.63 v125.98,61.47
  Bottom 0.203: v125.98,61.47 125.58,61.06 125.58,52.68 109.58,36.67 109.58,18.34 106.07,14.83 101.88,14.83 100.79,13.74 100.74,13.74 v100.74,11.71
ELEV_INB  (via drill 0.41)
  Top 0.203: U9.6 104.42,11.79 v104.39,11.81 | v126.49,60.45 125.98,60.45 124.3,62.13 IC1.17
  Bottom 0.203: v126.49,60.45 125.98,59.94 125.98,52.51 110.13,36.66 110.13,17.55 v104.39,11.81
ELEV_OUT_A
  Top 0.508: 99.34,9.25 99.34,9.3 U9.2
  Top 1.27: 99.34,9.3 U9.15 | 99.34,9.25 99.34,8.03
  pour Top (no thermals): 101.24,8.03 96.8,8.03 94.26,5.49 94.26,3.58 96.16,1.68 101.24,1.68 101.88,2.31 101.88,7.39
ELEV_OUT_B
  Top 0.508: U9.7 105.69,10.06 | 105.69,5.46 J16.2
  Top 0.813: U9.7 105.69,5.46
  Top 1.27: U9.10 105.69,10.06
  pour Top (no thermals): 109.5,8.03 103.78,8.03 103.15,7.39 103.15,2.31 103.78,1.68 108.86,1.68 110.13,2.95 110.13,7.39
ELEV_PWM  (via drill 0.41)
  Top 0.203: IC1.15 125.33,63.13 v125.48,62.99 | U9.11 104.42,16.15 106.43,18.16 v108.33,18.16
  Bottom 0.203: v125.48,62.99 125.17,62.69 125.17,52.84 108.99,36.66 108.99,19.2 108.33,18.54 v108.33,18.16
FROZEN1
  Top 0.508: U2.22 U2.23
  Top 0.635: U2.23 U2.24
  pour Top (no thermals): 124.99,9.88 124.99,8.86 128.66,5.2 130.08,5.2 131.09,4.19 131.09,3.28 131.6,2.77 132.61,2.77 133.12,3.28 133.12,5.82 129.06,9.88
FROZEN1_EN  (via drill 0.41)
  Top 0.203: IC1.5 122.44,68.14 v123.22,68.91 | v106.83,40.13 118.64,40.13 v122.17,36.6 | v118.8,28.68 120.42,28.68 124.97,24.13 124.97,19.14 U2.3
  Bottom 0.203: v123.22,68.91 123.22,55.19 108.16,40.13 v106.83,40.13 | v122.17,36.6 118.8,33.22 v118.8,28.68
FROZEN2
  Top 0.508: U2.19 U2.20 U2.21
  pour Top (no thermals): 122.45,8.86 123.22,8.1 123.22,6.72 126.9,3.04 127.8,3.94 127.8,5.04 123.98,8.86 123.98,9.37 122.45,9.37
FROZEN2_EN  (via drill 0.41)
  Top 0.203: IC1.40 129.27,41.06 126.64,38.43 v126.64,36.47 | v123.37,24.05 123.37,19.14 U2.5
  Bottom 0.203: v126.64,36.47 123.37,33.2 v123.37,24.05
FROZEN3
  Top 0.508: U2.16 U2.17 U2.18
  pour Top (no thermals): 120.09,9.37 120.09,4.82 121.77,3.15 122.65,4.04 122.65,7.65 121.95,8.36 121.95,9.37
FROZEN3_EN  (via drill 0.41)
  Top 0.203: IC1.39 128.77,41.5 125.3,38.02 v125.3,36.52 | v121.82,24 121.82,19.12 U2.7
  Bottom 0.203: v125.3,36.52 121.82,33.05 v121.82,24
FROZEN4
  Top 0.508: U2.14 U2.15
  Top 0.635: U2.13 U2.14
  pour Top (no thermals): 119.34,9.88 117.12,9.88 115.94,8.71 115.94,3.21 116.45,2.71 119.53,5.79 119.53,9.5
FROZEN4_EN  (via drill 0.41)
  Top 0.203: IC1.38 128.27,41.91 123.85,37.49 v123.85,36.58 | v120.22,24.03 120.22,19.12 U2.9
  Bottom 0.203: v123.85,36.58 120.22,32.94 v120.22,24.03
FUSE0-
  Top 1.27: D1.2 9.42,20.9 8.24,19.72 J12.P$1
  Bottom 1.27: F1.2 3.67,19.07 J12.P$1
FUSE1-
  Top 1.27: D2.2 9.69,8.43 6.58,11.54 J13.P$1
  Bottom 1.27: F2.2 3.12,11.63 J13.P$1
GND  (via drill 0.41, 3.3)
  Top 0.203: R16.1 56.57,22.07 | 56.57,22.07 R20.1 | R21.1 56.57,6.22 | 56.57,6.22 R17.1 | C11.2 131.77,74.71 IC1.81 | IC1.62 138.31,63.63 C9.2 139.1,64.35 | C6.2 125.27,53.39 IC1.32 | C5.1 123.31,47.57 v122.17,47.57 120.79,47.57 C4.1 | TP3.P$1 172.59,66.24 170.18,68.66 | C10.2 v121.41,76.2 121.41,76.3 121.4,76.31 121.4,77.44 C7.2 121.53,78.37 v120.24,79.65 | 194.31,83.31 195.22,82.4 J23.1 | LED5.C LED3.C 155.2,44.1 153.13,42.04 JP1.8 | LED4.C 141.22,57.25 LED2.C 141.22,52 v141.22,51.99 | C29.2 115.14,88.18 v114,89.33 | J19.6 123.47,96.09 TP6.P$1 | C28.2 135.1,87.97 v135.13,87.94 | 56.57,22.07 v57.91,22.07 | 56.57,6.22 57.86,6.22 v57.86,6.17 | C23.2 57.51,14.2 v57.58,14.28
  Top 0.254: U8.2 U8.1 49.15,28.9 C19.2 50.08,28.25 54.05,28.25 v57.76,31.95 | U6.2 U6.1 49.76,14.12 C23.2 | TP5.P$1 193.42,84.2 194.31,83.31 | C6.2 123.39,51.51 v122.78,51.51 | S1.4 102.47,49.17 v102.36,49.28 | C1.2 106.17,46.74 v105.66,46.23 | LED1.C 146.79,64.52 v148.34,64.52 | C9.2 139.06,65.66 v138.94,65.79 | v159.13,9.78 160.4,9.78 v161.29,8.89 | C27.2 163.15,87.57 | C2.2 139.1,64.35
  Top 0.305: IC1.99 122.77,73.36 121.45,74.72 C10.2 | IC1.11 116.82,65.14 C3.2 | J3.8 186.56,20.45 TP4.P$1
  Top 0.356: C10.2 120.9,75.44 C8.2 | C27.2 162.26,87.6 158.07,91.79 J18.2
  Top 0.406: C18.- v96.67,76.25 | C17.- 145.02,28.43 v144.88,28.57 | C16.- 127.01,26.84 v127.01,28.88 | U7.9 87.84,13.74 v88.8,13.74 | U7.1 75.78,10 v75.59,10.19 | U9.8 107.36,9.6 | Q6.G 185.67,51.44 185.67,38.61 J4.8 | U7.16 77.56,15.14 v76.5,15.14
  Top 0.508: U3.2 148.35,22.94 145.02,26.28 | U7.16 77.75,16.36 78.19,16.8 80.05,16.8 80.29,16.56 U7.14 | S1.4 102.45,47.53 | C21.2 80.71,18.61
  Top 0.61: 95.26,78.8 C18.- | C21.2 80.71,20.31 | U9.16 U9.1 | U9.9 U9.8
  Top 0.635: 80.71,20.31 79.16,21.86 C26.- 76.48,25.17 v76.45,25.15 | U7.14 80.29,18.19 80.71,18.61 | U9.14 100.61,17.04 98.7,17.04 98.07,16.41 U9.16 98,15.01 v95.63,15.01 | U7.16 U7.1 | U7.9 U7.8 | C16.- 126.77,22.6 125.8,21.63 U2.2 | 145.02,26.28 C17.- | C11.2 131.22,75.03 v130.73,75.51 | C3.2 v116.08,62.99 | S1.3 102.45,47.53 | 99.48,20.37 97.66,20.37 97.18,20.85 | 107.36,9.6 v109.58,9.6 | U9.1 95.59,10 v95.56,9.96 | v106.93,16.87 106.93,14.97 U9.9 | C25.2 100.6,18.39 99.64,18.39 | C22.- v97.16,25.17
  Top 1.27: 194.1,51.69 J22.1 | C22.- 99.48,20.37 C25.2 100.61,18.4 100.61,17.04 | C35.2 170.43,74.93 170.18,74.68 170.18,68.66 U10.4 v172.21,68.58 v173.48,68.58 v174.75,68.58 U10.2 180.97,68.58 C34.2 181.82,68.41 C33.2
  Top 2.54: Q6.G 194.1,51.69
  Bottom 0.203: C13.2 C12.2 | C15.2 C14.2
  Bottom 0.254: Q1.S 47.75,87.27 47.75,82.55 52.83,77.47 Q3.3 | C15.2 165.95,22.44 167.1,23.59 U1.5 168.28,26.29 168.28,27.05 167.39,27.94 C12.2 | R13.1 v159.13,9.78 | R10.1 166.33,8.89 v161.29,8.89
  Bottom 0.635: C38.2 106.66,86.98 U11.4 U11.2 99.77,82.47 C37.2 92.9,82.47 C36.2
  other vias: 96.85,14.99 96.77,9.93 196,4 196,96 99.57,19.05 95.76,22.86 97.03,22.86 98.3,22.86 98.3,21.59 97.03,21.59 95.76,21.59 95.76,20.32 97.03,20.32 98.3,20.32
  pour Bottom (rank 2): 203.37,-1.75 56.36,-1.75 56.36,103.06 203.37,103.06
  pour Top: 99.57,25.4 97.03,25.4 93.73,22.1 93.73,19.56 94.74,18.54 100.08,18.54 100.33,18.8 100.33,19.56 99.57,20.32
GND2  (via drill 0.41, 3.3)
  Top 0.203: U8.5 48.49,22.12 49.25,21.36 | U6.5 49.1,7.19 49.68,6.6
  Top 0.254: D6.1 18.41,57.15
  Top 1.27: 49.25,21.36 R23.1 | 49.68,6.6 R22.1
  Top 1.905: 18.41,57.15 D6.3 | D4.1 D4.3 | C30.- 53.94,54.65 53.98,54.61 53.98,43.22 C31.- | v12.7,58.17 v12.7,56.64
  other vias: 51.05,22.78 52.32,22.78 53.62,22.81 51.03,21.56 52.32,21.56 53.62,21.54 51.05,20.07 52.37,20.07 53.59,20.04 51.69,7.9 52.93,7.92 54.13,7.95 54.25,6.63 52.96,6.63 51.64,6.58 51.69,5.26 52.96,5.31 54.23,5.33 4,4 4,96 12.7,55.12 14.22,55.12 14.22,56.64 14.22,58.17 22.61,53.85 23.88,53.85 22.61,55.12 23.88,55.12 12.45,38.35 14.22,38.35 14.22,36.83 12.45,36.83 12.45,35.31 14.22,35.31 14.22,34.04 12.45,34.04
  pour Top: 49.02,22.5 49.02,20.17 49.94,19.25 54.03,19.25 54.61,19.84 54.61,22.99 54.03,23.57 50.09,23.57
  pour Top: 49.5,7.65 49.5,5.11 50.42,4.19 54.51,4.19 55.09,4.78 55.09,7.92 54.51,8.51 50.37,8.51
  pour Bottom (rank 2): -1.09,102.23 55.22,102.23 55.22,-2.69 -1.65,-2.69 -1.65,102.29
  pour Top: 11.18,58.42 11.18,53.85 12.19,52.83 23.88,52.83 24.89,53.85 24.89,58.42 23.37,59.94 12.7,59.94
  pour Top: 10.92,38.86 10.92,34.29 11.94,33.27 23.62,33.27 24.64,34.29 24.64,38.86 23.11,40.39 12.45,40.39
HEATPUMP_EN  (via drill 0.41)
  Top 0.203: IC1.55 127.95,60.13 127.25,59.44 124.21,59.44 v122.43,61.21
  Bottom 0.203: v122.43,61.21 116.84,66.8 73.66,66.8 64.01,76.45 64.01,78.49 61.47,81.03 53.09,81.03 49.28,84.84 49.28,89.66 46.29,92.64 Q1.G
LIMIT_SENSE
  Top 0.203: J18.1 155.51,96.23 R25.2 155.51,86.98 147.37,78.84 147.37,77.03 141.5,71.16 141.5,68.96 140.18,67.64 IC1.70
LIQUID1
  Top 0.508: U3.22 U3.23
  Top 0.635: U3.23 U3.24
  pour Top (no thermals): 147.42,9.53 147.42,8.51 148.31,7.62 151.36,7.62 154.76,4.22 154.76,2.97 156.24,2.97 156.6,3.33 156.6,5.81 152.63,9.78 147.68,9.78
LIQUID1_EN  (via drill 0.41)
  Top 0.203: IC1.37 127.77,42.55 v127.46,42.24 | v141.6,25.88 141.65,25.88 147.56,19.98 U3.3
  Bottom 0.203: v127.46,42.24 131.06,42.24 141.6,31.7 v141.6,25.88
LIQUID2
  Top 0.508: U3.19 U3.20 U3.21
  pour Top (no thermals): 145.14,8.89 145.64,8.38 145.64,6.61 146.97,5.28 148.5,5.28 150.74,3.04 151.29,3.58 151.29,5.02 149.33,6.99 148.18,6.99 146.91,8.26 146.91,9.53 145.14,9.53
LIQUID2_EN  (via drill 0.41)
  Top 0.203: IC1.36 127.27,43.68 v126.57,42.98 | v140.31,25.96 145.96,20.31 U3.5
  Bottom 0.203: v126.57,42.98 126.57,41.99 127.53,41.02 131.19,41.02 140.31,31.9 v140.31,25.96
LIQUID3
  Top 0.508: U3.16 U3.17 U3.18
  pour Top (no thermals): 142.72,9.53 142.72,6.44 145.22,2.88 145.97,2.88 146.48,3.2 146.48,4.62 145,6.1 144.98,8.28 144.5,8.76 144.5,9.53
LIQUID3_EN  (via drill 0.41)
  Top 0.203: IC1.35 126.77,46.73 v125.81,45.77 | v139.04,25.93 144.35,20.62 U3.7
  Bottom 0.203: v125.81,45.77 125.81,41.66 127.33,40.13 130.89,40.13 139.04,31.98 v139.04,25.93
M0  (via drill 0.41)
  Top 0.203: IC1.60 128.83,62.63 126.49,64.97 124.35,64.97 v122.43,66.89 | v77.98,69.95 76.89,69.95 J7.M0
  Bottom 0.203: v122.43,66.89 119.23,66.89 117.6,68.53 84.78,68.53 83.36,69.95 v77.98,69.95
M1  (via drill 0.41)
  Top 0.203: IC1.59 128.75,62.13 126.32,64.57 123.74,64.57 v122.43,65.88 | v80.26,69.09 74.24,75.11 J7.M1
  Bottom 0.203: v122.43,65.88 119.67,65.88 117.43,68.12 84.23,68.12 83.21,69.14 80.31,69.14 v80.26,69.09
M2  (via drill 0.41)
  Top 0.203: IC1.58 128.68,61.63 126.15,64.16 123.13,64.16 v122.43,64.86 | v82.6,68.25 76.78,74.07 J7.M2
  Bottom 0.203: v122.43,64.86 120.12,64.86 117.26,67.72 83.13,67.72 v82.6,68.25
M+  (via drill 0.41)
  Top 1.905: F3.2 18.99,45.09 D4.4 | D3.1 D3.3 | v17.32,47.7 v18.59,47.7 | D4.4 20.32,47.24 v19.86,47.7 | D4.4 18.59,48.15 v18.59,48.97 | v17.32,48.97 17.77,48.97 D4.4 | D4.4 19.86,46.88 v19.86,48.97 | D4.4 20.32,49.68 20.37,49.73
  Top 2.54: D3.3 32.82,49.73 20.37,49.73
  Bottom 1.905: K1.NO 18.59,67.45 v18.59,48.97
  other vias: 19.86,50.24 17.32,50.24 18.59,50.24
  pour Bottom: 16.69,50.88 20.5,50.88 20.5,47.07 16.69,47.07
M+_IN
  Top 1.905: F3.1 2.92,50.59 J21.2
M-
  Top 1.905: D5.1 D5.3 | 23.43,69.85 D6.4
  Top 2.54: D6.4 14.07,66.74 J21.1 5.21,57.87 J15.2 | D5.3 23.43,69.85
MISO
  Top 0.254: JP11.1 TP8.P$1 110.62,58.8 111.45,59.63 IC1.22
MOSI
  Top 0.254: JP11.4 103.5,61.34 104.65,60.2 108.84,60.2 TP7.P$1 109.03,60.13 IC1.21
N$1
  Top 1.27: C33.1 183.55,66.71 183.13,66.29 C34.1 181.47,66.28 U10.1 180.02,62.61 D7.2
N$2
  Top 0.203: R7.2 LED5.A
N$3
  Top 0.203: R3.2 LED1.A
N$4
  Bottom 0.635: C36.1 96.38,80.73 C37.1 100.29,80.7 U11.1 98.99,79.39 D8.2
N$5
  Top 0.203: R5.2 153.1,43.49 LED3.A
N$7
  Top 0.203: U5.2 56.78,9.37 R17.2
N$9
  Top 0.203: R6.2 143.4,57.33 LED4.A
N$10
  Top 0.203: R4.2 143.35,53.85 LED2.A
N$13
  Top 0.203: Y1.1 116.23,43.43 118.66,46.01 C4.2 118.93,49.04 120.18,50.29 R2.1
N$14
  Top 0.203: U4.2 59.53,25.46 R16.2
PIVOT_ENC_A
  Top 0.203: IC1.6 118.14,67.64 116.38,69.39 116.38,84.63 110.67,90.35 J19.3
PIVOT_ENC_B
  Top 0.203: IC1.7 117.89,67.14 115.98,69.05 115.98,84.28 108.13,92.12 J19.2
PIVOT_INA  (via drill 0.41)
  Top 0.203: IC1.63 129.72,64.14 v128.14,65.71 | v80.31,12.52 80.29,12.5 U7.3
  Bottom 0.203: v128.14,65.71 127.1,66.75 125.6,66.75 124.64,65.79 124.64,54.89 89.61,19.86 89.61,16.38 84.33,11.1 81.74,11.1 v80.31,12.52
PIVOT_INB  (via drill 0.41)
  Top 0.203: IC1.64 130.94,64.64 v129.03,66.55 | v84.1,12.57 U7.6
  Bottom 0.203: v129.03,66.55 128.32,67.26 125.25,67.26 124.23,66.24 124.23,55.05 89.2,20.03 89.2,17.5 84.28,12.57 v84.1,12.57
PIVOT_OUT_A
  Top 0.635: U7.2 U7.15
  Top 0.813: U7.2 79.02,5.61 J11.1
  pour Top (no thermals): 79.02,8.03 77.75,6.76 75.84,6.76 74.57,5.49 74.57,2.31 75.84,1.04 80.42,1.04 81.56,2.18 81.56,7.39 80.92,8.03
PIVOT_OUT_B
  Top 0.635: U7.7 U7.10
  Top 0.813: U7.7 85.37,5.51 J11.2
  pour Top (no thermals): 89.18,8.03 84.1,8.03 82.83,6.76 82.83,2.57 83.72,1.68 88.54,1.68 90.45,3.58 90.45,6.76
PIVOT_PWM  (via drill 0.41)
  Top 0.203: IC1.1 120.31,70.09 125.23,70.09 v125.72,69.6 v125.73,69.6 | v88.19,18.03 86.69,16.54 84.48,16.54 84.1,16.15 U7.11
  Bottom 0.203: v125.73,69.6 125.69,69.6 123.83,67.73 123.83,55.22 88.19,19.59 v88.19,18.03
POWDER1
  Top 0.508: U3.14 U3.15
  Top 0.635: U3.13 U3.14
  pour Top (no thermals): 141.45,9.78 140.12,9.78 138.89,8.55 138.89,4.51 140.33,3.08 142.09,4.83 142.09,9.14
POWDER1_EN  (via drill 0.41)
  Top 0.203: IC1.41 129.77,39.6 v130,39.37 | v137.77,25.91 142.75,20.92 U3.9
  Bottom 0.203: v130,39.37 137.77,31.6 v137.77,25.91
RELAY-
  Bottom 0.635: Q1.D 30.48,91.69 26.64,95.53 K1.A1
RESET  (via drill 0.41)
  Top 0.203: S1.1 S1.2
  Top 0.254: IC1.30 124.25,56.12 124.25,54.64 123.46,53.85 108.85,53.85 107.13,52.12 107.13,52.17 | v107.14,55.55 107.13,55.54 107.13,52.17 | S1.2 104.95,52.03 R1.1 106.17,51.22 | 106.17,51.22 C1.1 | 106.17,51.22 107.13,52.17
  Bottom 0.203: v107.14,55.55 107.12,55.56 107.12,62.55 JP11.5
SCK
  Top 0.254: JP11.3 TP9.P$1 109.35,61.34 110.05,60.63 IC1.20
SCL  (via drill 0.41)
  Top 0.203: IC1.43 130.77,43.88 v133.86,40.79
  Top 0.254: R14.1 169.47,35.84 J1.1 171.53,35.81 TP14.P$1
  Top 0.305: J1.1 169.44,30.89 167.39,28.83 v167.39,26.67
  Bottom 0.203: U1.4 166.6,25.88 v167.39,26.67 | J1.1 164.47,40.79 v133.86,40.79
SDA  (via drill 0.41)
  Top 0.203: IC1.44 131.27,44.65 135.84,40.08 v135.84,39.52
  Top 0.254: R15.1 166.42,36.3 J1.2 164.62,35.81 TP15.P$1
  Top 0.305: v166.12,26.67 166.12,29.59 166.9,30.38 J1.2
  Bottom 0.203: U1.3 166.1,26.65 v166.12,26.67 | J1.2 163.19,39.52 v135.84,39.52
STEP
  Top 0.203: IC1.26 122.27,54.96 121.67,54.36 117.6,54.36 115.57,56.39 88.92,56.39 84.35,60.96 84.35,75.08 J7.STEP
THERMISTOR0
  Top 0.203: J19.5 117.95,93.89 R29.1 C29.1 117.95,84.97 124.23,78.69 124.23,74.27 123.77,73.81 IC1.97
THERMISTOR1
  Top 0.203: J20.2 131.63,96.11 R28.1 C28.1 131.67,87.92 131.67,86.72 124.64,79.68 124.64,74.1 124.27,73.73 IC1.96
V-5_LOAD  (via drill 0.41)
  Top 0.254: TP19.P$1 95.4,90.22 95.4,88.32 JP20.1 | 48.44,14.12 U6.3 | U8.3 47.83,28.79 C19.1
  Top 0.305: C19.1 47.64,29.83 47.88,30.07 52.3,30.07 v52.91,29.46 | v48.39,17.37 48.39,14.34 C23.1
  Top 0.406: v73.41,70.87 72.39,70.87 v70.36,68.83 56.9,55.37 56.9,33.45 v52.91,29.46
  Top 0.508: C23.1 48.36,14.2 48.44,14.12
  Top 0.635: v94.36,92.08 v94.36,90.55
  Bottom 0.203: 62.45,68.02 Q2.G
  Bottom 0.305: v52.91,29.46 53.24,29.13 53.24,27.94 48.39,23.09 v48.39,17.37
  Bottom 0.406: R18.2 62.45,68.02 | Q2.G 69.64,68.11 v70.36,68.83 | v94.36,89.03 94.36,87.63 J7./SLEEP J7./RESET 75.06,70.87 v73.41,70.87
  Bottom 0.635: C38.1 102.12,87.13 U11.3
  other vias: 92.33,90.55 92.33,92.08
  pour Bottom: 100.99,85.14 102.51,86.66 102.51,91.34 101.14,92.71 89.69,92.71 88.8,91.82 88.8,90.73 89.81,89.71 92.35,89.71 96.93,85.14
  pour Top: 89.51,92.76 88.8,92.05 88.8,90.73 89.81,89.71 92.35,89.71 94.89,87.17 95.91,87.17 95.91,89.71 96.42,90.22 96.42,92.76
V-12V_PROT
  Top 0.508: 117.8,17.33 U2.12 117.8,20.53 114.5,23.82 114.5,32.89 | 149.16,18.12 U3.1 149.16,25.88 | 140.35,17.86 U3.12 135.74,23.88 135.74,32.5 | 126.64,17.11 126.6,17.15 U2.1 127.6,19.11 131.57,23.07 C16.+ 131.57,32.77 | U2.25 120.55,15.98 119.15,15.98
  Top 0.61: 79.5,32.89 85.67,32.89 | 149.16,25.88 C17.+ | 135.74,32.5 135.36,32.88
  Top 0.635: U7.4 U7.5 U7.12 82.83,17.55 82.41,17.97 C21.1 83.96,20.37 83.96,24.89 C26.+ | TP17.P$1 179.2,53.76 Q6.D | 117.8,17.33 119.15,15.98 125.5,15.98 126.64,17.11 | 149.16,18.12 145.52,14.48 U3.25 143.74,14.48 140.35,17.86 | U5.4 62.15,3.02 62.92,3.79 62.92,16.99 U4.4 65.51,18.9 79.5,32.89
  Top 0.813: C17.+ 149.82,32.14 149.09,32.88 | 131.57,32.77 131.67,32.88 | 104.28,32.83 104.22,32.89 | C22.+ 104.28,20.37 | 83.96,31.18 85.67,32.89
  Top 1.143: U9.12 U9.5 U9.4
  Top 1.27: 104.28,20.37 C25.1 102.73,17.97 103.15,17.55 U9.12 | 83.96,24.89 83.96,31.18
  Top 1.905: C22.+ 104.28,32.83
  Top 5.715: Q6.D 170.18,53.98 149.09,32.88 135.36,32.88 131.67,32.88 125.97,32.88 125.96,32.89 114.5,32.89 104.22,32.89 85.67,32.89
  pour Top (no thermals): 87.27,25.81 82.19,25.81 82.19,18.19 87.27,18.19
  pour Top (no thermals): 107.59,25.81 102.51,25.81 102.51,18.19 107.59,18.19
  pour Top (no thermals): 149.1,26.42 149.1,18.8 149.35,18.54 153.92,18.54 154.43,19.05 154.43,25.4 153.42,26.42
V-HEATPUMP
  Top 1.905: K1.COM 15.89,84.95 J15.1
V-HVDC  (via drill 0.41)
  Top 1.27: D3.4 34.53,40.97 v33.91,40.97
  Top 1.905: C30.+ C32.+ C31.+
  Bottom 1.27: F1.1 17.75,19.07 17.83,19 | F2.1 17.74,11.63 17.83,11.54
  Bottom 3.175: 17.83,11.54 17.83,19 17.83,27.99 28.7,38.86 31.55,38.86
  other vias: 31.37,40.97 36.45,40.97 38.99,40.97 38.99,39.07 36.45,39.07 33.91,39.07 31.37,39.07 31.37,37.16 33.91,37.16 36.45,37.16 38.99,37.16
  pour Top (no thermals): 50.16,68.58 50.16,35.56 32.38,35.56 42.55,45.72 42.55,53.98 40.64,55.88 40.64,64.14 45.09,68.58
  pour Top (no thermals): 40.64,44.45 30.48,44.45 29.84,43.81 29.84,35.56 41.27,35.56 41.27,44.45
  pour Bottom: 30.56,41.71 30.56,36.42 39.88,36.42 39.88,41.71
V-STEPPER
  Top 0.508: J7.V-STEPPER 69.16,94.82 J8.6 64.69,96.19 TP16.P$1
  Top 0.61: JP20.2 C18.+ 73.39,83.6 J7.V-STEPPER
XTAL1
  Top 0.203: Y1.2 122.86,44.73 125.44,47.31 C5.2 126.27,49.11 IC1.34
XTAL2
  Top 0.203: R2.2 125.73,51.35 125.73,56.09 IC1.33

## Text on the board
tPlace: Coolant | GND | T0 | GND | GND | T1 | Hall | 5V | Hall | GND | 5V | Hall | GND | 5V | Hall | GND | 5V | Load | 5V | GND | Load | 5V | B2 | B1 | A1 | A2 | 5V | GND | VMOT | GND | ENC_B | ENC_A | GND | Heat-Pump | 5V | 12V | Mains | + | CURR1 | CURR0 | - | 12V_IN | 10A | B0_EN | B1_EN | + | - | + | - | GND | GND | GND | GND | L1 | GND | F4 | F3 | F2 | GND | F1 | GND | P1 | L3 | L2 | GND | B1_EN | B0_EN
bPlace: 7A | 7A